# Altium project PreTriggerECAL.PrjPCB (part 3 of 3)

## Sheet In-Channels.SchDoc
size A4; DocumentNumber: 2; SheetNumber: 2; SheetTotal: 6
Used 16 times, as channels In_Ch1, In_Ch2, In_Ch3, In_Ch4, In_Ch5, In_Ch6, In_Ch7, In_Ch8, In_Ch9, In_Ch16, In_Ch15, In_Ch14, In_Ch13, In_Ch12, In_Ch11, In_Ch10. Parts and nets are listed once, with the designators drawn on the sheet.
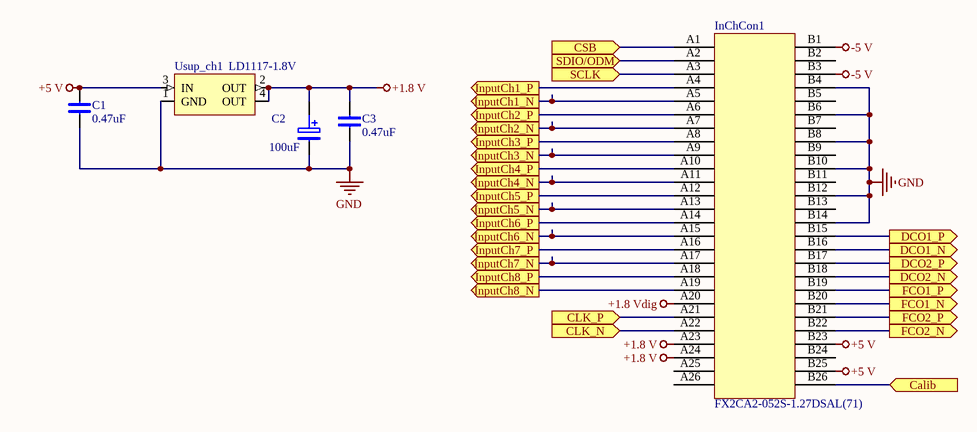
[diagram p6: In-Channels.SchDoc]

### Parts
C1  0.47uF  [chip0603]
C2  100uF  [CEL-SMD300]
C3  0.47uF  [chip0603]
InChCon1  FX2CA2-052S-1.27DSAL(71)  [FX2CA2-052S-1.27DSAL(71)]
Usup_ch1  LD1117-1.8V  [TO-252]

### Ports
Calib (in), CLK_N (in), CLK_P (in), CSB (in), DCO1_N (out), DCO1_P (out), DCO2_N (out), DCO2_P (out), FCO1_N (out), FCO1_P (out), FCO2_N (out), FCO2_P (out), InputCh1_N (out), InputCh1_P (out), InputCh2_N (out), InputCh2_P (out), InputCh3_N (out), InputCh3_P (out), InputCh4_N (out), InputCh4_P (out), InputCh5_N (out), InputCh5_P (out), InputCh6_N (out), InputCh6_P (out), InputCh7_N (out), InputCh7_P (out), InputCh8_N (out), InputCh8_P (out), SCLK (in), SDIO/ODM (in)

### Nets
+1.8 V: C2.+ C3.1 InChCon1.A23 InChCon1.A24 Usup_ch1.2(OUT) Usup_ch1.4(OUT)
+1.8 Vdig: InChCon1.A20
+5 V: C1.1 InChCon1.B23 InChCon1.B25 Usup_ch1.3(IN)
-5 V: InChCon1.B1 InChCon1.B3
GND: C1.2 C2.- C3.2 InChCon1.B4 InChCon1.B6 InChCon1.B8 InChCon1.B10 InChCon1.B12 InChCon1.B14 Usup_ch1.1(GND)
Calib: InChCon1.B26 ; port Calib
CLK_N: InChCon1.A22 ; port CLK_N
CLK_P: InChCon1.A21 ; port CLK_P
CSB: InChCon1.A1 ; port CSB
DCO1_N: InChCon1.B16 ; port DCO1_N
DCO1_P: InChCon1.B15 ; port DCO1_P
DCO2_N: InChCon1.B18 ; port DCO2_N
DCO2_P: InChCon1.B17 ; port DCO2_P
FCO1_N: InChCon1.B20 ; port FCO1_N
FCO1_P: InChCon1.B19 ; port FCO1_P
FCO2_N: InChCon1.B22 ; port FCO2_N
FCO2_P: InChCon1.B21 ; port FCO2_P
InputCh1_N: InChCon1.A5 ; port InputCh1_N
InputCh1_P: InChCon1.A4 ; port InputCh1_P
InputCh2_N: InChCon1.A7 ; port InputCh2_N
InputCh2_P: InChCon1.A6 ; port InputCh2_P
InputCh3_N: InChCon1.A9 ; port InputCh3_N
InputCh3_P: InChCon1.A8 ; port InputCh3_P
InputCh4_N: InChCon1.A11 ; port InputCh4_N
InputCh4_P: InChCon1.A10 ; port InputCh4_P
InputCh5_N: InChCon1.A13 ; port InputCh5_N
InputCh5_P: InChCon1.A12 ; port InputCh5_P
InputCh6_N: InChCon1.A15 ; port InputCh6_N
InputCh6_P: InChCon1.A14 ; port InputCh6_P
InputCh7_N: InChCon1.A17 ; port InputCh7_N
InputCh7_P: InChCon1.A16 ; port InputCh7_P
InputCh8_N: InChCon1.A19 ; port InputCh8_N
InputCh8_P: InChCon1.A18 ; port InputCh8_P
SCLK: InChCon1.A3 ; port SCLK
SDIO/ODM: InChCon1.A2 ; port SDIO/ODM

Not connected (* = marked no-connect by the designer): InChCon1 A25 A26 B2(2) B5(5) B7(7) B9(9) B11(11) B13(13) B24

### Channels
In_Ch1: designators end in _In_Ch1; ports Calib=Calib CLK_N=ADC_DOWN_CLK_N CLK_P=ADC_DOWN_CLK_P CSB=ADC_CSB DCO1_N=DCO_N_1 DCO1_P=DCO_P_1 DCO2_N=DCO_N_2 DCO2_P=DCO_P_2 FCO1_N=FCO_N_1 FCO1_P=FCO_P_1 FCO2_N=FCO_N_2 FCO2_P=FCO_P_2 InputCh1_N=Part1_InputCh1_N InputCh1_P=Part1_InputCh1_P InputCh2_N=Part1_InputCh2_N InputCh2_P=Part1_InputCh2_P InputCh3_N=Part1_InputCh3_N InputCh3_P=Part1_InputCh3_P InputCh4_N=Part1_InputCh4_N InputCh4_P=Part1_InputCh4_P InputCh5_N=Part1_InputCh5_N InputCh5_P=Part1_InputCh5_P InputCh6_N=Part1_InputCh6_N InputCh6_P=Part1_InputCh6_P InputCh7_N=Part1_InputCh7_N InputCh7_P=Part1_InputCh7_P InputCh8_N=Part1_InputCh8_N InputCh8_P=Part1_InputCh8_P SCLK=ADC_SCLK SDIO/ODM=ADC_SDIO/ODM
In_Ch2: designators end in _In_Ch2; ports Calib=Calib CLK_N=ADC_DOWN_CLK_N CLK_P=ADC_DOWN_CLK_P CSB=ADC_CSB DCO1_N=DCO_N_3 DCO1_P=DCO_P_3 DCO2_N=DCO_N_4 DCO2_P=DCO_P_4 FCO1_N=FCO_N_3 FCO1_P=FCO_P_3 FCO2_N=FCO_N_4 FCO2_P=FCO_P_4 InputCh1_N=Part2_InputCh1_N InputCh1_P=Part2_InputCh1_P InputCh2_N=Part2_InputCh2_N InputCh2_P=Part2_InputCh2_P InputCh3_N=Part2_InputCh3_N InputCh3_P=Part2_InputCh3_P InputCh4_N=Part2_InputCh4_N InputCh4_P=Part2_InputCh4_P InputCh5_N=Part2_InputCh5_N InputCh5_P=Part2_InputCh5_P InputCh6_N=Part2_InputCh6_N InputCh6_P=Part2_InputCh6_P InputCh7_N=Part2_InputCh7_N InputCh7_P=Part2_InputCh7_P InputCh8_N=Part2_InputCh8_N InputCh8_P=Part2_InputCh8_P SCLK=ADC_SCLK SDIO/ODM=ADC_SDIO/ODM
In_Ch3: designators end in _In_Ch3; ports Calib=Calib CLK_N=ADC_DOWN_CLK_N CLK_P=ADC_DOWN_CLK_P CSB=ADC_CSB DCO1_N=DCO_N_5 DCO1_P=DCO_P_5 DCO2_N=DCO_N_6 DCO2_P=DCO_P_6 FCO1_N=FCO_N_5 FCO1_P=FCO_P_5 FCO2_N=FCO_N_6 FCO2_P=FCO_P_6 InputCh1_N=Part3_InputCh1_N InputCh1_P=Part3_InputCh1_P InputCh2_N=Part3_InputCh2_N InputCh2_P=Part3_InputCh2_P InputCh3_N=Part3_InputCh3_N InputCh3_P=Part3_InputCh3_P InputCh4_N=Part3_InputCh4_N InputCh4_P=Part3_InputCh4_P InputCh5_N=Part3_InputCh5_N InputCh5_P=Part3_InputCh5_P InputCh6_N=Part3_InputCh6_N InputCh6_P=Part3_InputCh6_P InputCh7_N=Part3_InputCh7_N InputCh7_P=Part3_InputCh7_P InputCh8_N=Part3_InputCh8_N InputCh8_P=Part3_InputCh8_P SCLK=ADC_SCLK SDIO/ODM=ADC_SDIO/ODM
In_Ch4: designators end in _In_Ch4; ports Calib=Calib CLK_N=ADC_DOWN_CLK_N CLK_P=ADC_DOWN_CLK_P CSB=ADC_CSB DCO1_N=DCO_N_7 DCO1_P=DCO_P_7 DCO2_N=DCO_N_8 DCO2_P=DCO_P_8 FCO1_N=FCO_N_7 FCO1_P=FCO_P_7 FCO2_N=FCO_N_8 FCO2_P=FCO_P_8 InputCh1_N=Part4_InputCh1_N InputCh1_P=Part4_InputCh1_P InputCh2_N=Part4_InputCh2_N InputCh2_P=Part4_InputCh2_P InputCh3_N=Part4_InputCh3_N InputCh3_P=Part4_InputCh3_P InputCh4_N=Part4_InputCh4_N InputCh4_P=Part4_InputCh4_P InputCh5_N=Part4_InputCh5_N InputCh5_P=Part4_InputCh5_P InputCh6_N=Part4_InputCh6_N InputCh6_P=Part4_InputCh6_P InputCh7_N=Part4_InputCh7_N InputCh7_P=Part4_InputCh7_P InputCh8_N=Part4_InputCh8_N InputCh8_P=Part4_InputCh8_P SCLK=ADC_SCLK SDIO/ODM=ADC_SDIO/ODM
In_Ch5: designators end in _In_Ch5; ports Calib=Calib CLK_N=ADC_DOWN_CLK_N CLK_P=ADC_DOWN_CLK_P CSB=ADC_CSB DCO1_N=DCO_N_9 DCO1_P=DCO_P_9 DCO2_N=DCO_N_10 DCO2_P=DCO_P_10 FCO1_N=FCO_N_9 FCO1_P=FCO_P_9 FCO2_N=FCO_N_10 FCO2_P=FCO_P_10 InputCh1_N=Part5_InputCh1_N InputCh1_P=Part5_InputCh1_P InputCh2_N=Part5_InputCh2_N InputCh2_P=Part5_InputCh2_P InputCh3_N=Part5_InputCh3_N InputCh3_P=Part5_InputCh3_P InputCh4_N=Part5_InputCh4_N InputCh4_P=Part5_InputCh4_P InputCh5_N=Part5_InputCh5_N InputCh5_P=Part5_InputCh5_P InputCh6_N=Part5_InputCh6_N InputCh6_P=Part5_InputCh6_P InputCh7_N=Part5_InputCh7_N InputCh7_P=Part5_InputCh7_P InputCh8_N=Part5_InputCh8_N InputCh8_P=Part5_InputCh8_P SCLK=ADC_SCLK SDIO/ODM=ADC_SDIO/ODM
In_Ch6: designators end in _In_Ch6; ports Calib=Calib CLK_N=ADC_DOWN_CLK_N CLK_P=ADC_DOWN_CLK_P CSB=ADC_CSB DCO1_N=DCO_N_11 DCO1_P=DCO_P_11 DCO2_N=DCO_N_12 DCO2_P=DCO_P_12 FCO1_N=FCO_N_11 FCO1_P=FCO_P_11 FCO2_N=FCO_N_12 FCO2_P=FCO_P_12 InputCh1_N=Part6_InputCh1_N InputCh1_P=Part6_InputCh1_P InputCh2_N=Part6_InputCh2_N InputCh2_P=Part6_InputCh2_P InputCh3_N=Part6_InputCh3_N InputCh3_P=Part6_InputCh3_P InputCh4_N=Part6_InputCh4_N InputCh4_P=Part6_InputCh4_P InputCh5_N=Part6_InputCh5_N InputCh5_P=Part6_InputCh5_P InputCh6_N=Part6_InputCh6_N InputCh6_P=Part6_InputCh6_P InputCh7_N=Part6_InputCh7_N InputCh7_P=Part6_InputCh7_P InputCh8_N=Part6_InputCh8_N InputCh8_P=Part6_InputCh8_P SCLK=ADC_SCLK SDIO/ODM=ADC_SDIO/ODM
In_Ch7: designators end in _In_Ch7; ports Calib=Calib CLK_N=ADC_DOWN_CLK_N CLK_P=ADC_DOWN_CLK_P CSB=ADC_CSB DCO1_N=DCO_N_13 DCO1_P=DCO_P_13 DCO2_N=DCO_N_14 DCO2_P=DCO_P_14 FCO1_N=FCO_N_13 FCO1_P=FCO_P_13 FCO2_N=FCO_N_14 FCO2_P=FCO_P_14 InputCh1_N=Part7_InputCh1_N InputCh1_P=Part7_InputCh1_P InputCh2_N=Part7_InputCh2_N InputCh2_P=Part7_InputCh2_P InputCh3_N=Part7_InputCh3_N InputCh3_P=Part7_InputCh3_P InputCh4_N=Part7_InputCh4_N InputCh4_P=Part7_InputCh4_P InputCh5_N=Part7_InputCh5_N InputCh5_P=Part7_InputCh5_P InputCh6_N=Part7_InputCh6_N InputCh6_P=Part7_InputCh6_P InputCh7_N=Part7_InputCh7_N InputCh7_P=Part7_InputCh7_P InputCh8_N=Part7_InputCh8_N InputCh8_P=Part7_InputCh8_P SCLK=ADC_SCLK SDIO/ODM=ADC_SDIO/ODM
In_Ch8: designators end in _In_Ch8; ports Calib=Calib CLK_N=ADC_DOWN_CLK_N CLK_P=ADC_DOWN_CLK_P CSB=ADC_CSB DCO1_N=DCO_N_15 DCO1_P=DCO_P_15 DCO2_N=DCO_N_16 DCO2_P=DCO_P_16 FCO1_N=FCO_N_15 FCO1_P=FCO_P_15 FCO2_N=FCO_N_16 FCO2_P=FCO_P_16 InputCh1_N=Part8_InputCh1_N InputCh1_P=Part8_InputCh1_P InputCh2_N=Part8_InputCh2_N InputCh2_P=Part8_InputCh2_P InputCh3_N=Part8_InputCh3_N InputCh3_P=Part8_InputCh3_P InputCh4_N=Part8_InputCh4_N InputCh4_P=Part8_InputCh4_P InputCh5_N=Part8_InputCh5_N InputCh5_P=Part8_InputCh5_P InputCh6_N=Part8_InputCh6_N InputCh6_P=Part8_InputCh6_P InputCh7_N=Part8_InputCh7_N InputCh7_P=Part8_InputCh7_P InputCh8_N=Part8_InputCh8_N InputCh8_P=Part8_InputCh8_P SCLK=ADC_SCLK SDIO/ODM=ADC_SDIO/ODM
In_Ch9: designators end in _In_Ch9; ports Calib=Calib CLK_N=ADC_UP_CLK_N CLK_P=ADC_UP_CLK_P CSB=ADC_CSB DCO1_N=DCO_N_17 DCO1_P=DCO_P_17 DCO2_N=DCO_N_18 DCO2_P=DCO_P_18 FCO1_N=FCO_N_17 FCO1_P=FCO_P_17 FCO2_N=FCO_N_18 FCO2_P=FCO_P_18 InputCh1_N=Part9_InputCh1_N InputCh1_P=Part9_InputCh1_P InputCh2_N=Part9_InputCh2_N InputCh2_P=Part9_InputCh2_P InputCh3_N=Part9_InputCh3_N InputCh3_P=Part9_InputCh3_P InputCh4_N=Part9_InputCh4_N InputCh4_P=Part9_InputCh4_P InputCh5_N=Part9_InputCh5_N InputCh5_P=Part9_InputCh5_P InputCh6_N=Part9_InputCh6_N InputCh6_P=Part9_InputCh6_P InputCh7_N=Part9_InputCh7_N InputCh7_P=Part9_InputCh7_P InputCh8_N=Part9_InputCh8_N InputCh8_P=Part9_InputCh8_P SCLK=ADC_SCLK SDIO/ODM=ADC_SDIO/ODM
In_Ch16: designators end in _In_Ch16; ports Calib=Calib CLK_N=ADC_UP_CLK_N CLK_P=ADC_UP_CLK_P CSB=ADC_CSB DCO1_N=DCO_N_31 DCO1_P=DCO_P_31 DCO2_N=DCO_N_32 DCO2_P=DCO_P_32 FCO1_N=FCO_N_31 FCO1_P=FCO_P_31 FCO2_N=FCO_N_32 FCO2_P=FCO_P_32 InputCh1_N=Part16_InputCh1_N InputCh1_P=Part16_InputCh1_P InputCh2_N=Part16_InputCh2_N InputCh2_P=Part16_InputCh2_P InputCh3_N=Part16_InputCh3_N InputCh3_P=Part16_InputCh3_P InputCh4_N=Part16_InputCh4_N InputCh4_P=Part16_InputCh4_P InputCh5_N=Part16_InputCh5_N InputCh5_P=Part16_InputCh5_P InputCh6_N=Part16_InputCh6_N InputCh6_P=Part16_InputCh6_P InputCh7_N=Part16_InputCh7_N InputCh7_P=Part16_InputCh7_P InputCh8_N=Part16_InputCh8_N InputCh8_P=Part16_InputCh8_P SCLK=ADC_SCLK SDIO/ODM=ADC_SDIO/ODM
In_Ch15: designators end in _In_Ch15; ports Calib=Calib CLK_N=ADC_UP_CLK_N CLK_P=ADC_UP_CLK_P CSB=ADC_CSB DCO1_N=DCO_N_29 DCO1_P=DCO_P_29 DCO2_N=DCO_N_30 DCO2_P=DCO_P_30 FCO1_N=FCO_N_29 FCO1_P=FCO_P_29 FCO2_N=FCO_N_30 FCO2_P=FCO_P_30 InputCh1_N=Part15_InputCh1_N InputCh1_P=Part15_InputCh1_P InputCh2_N=Part15_InputCh2_N InputCh2_P=Part15_InputCh2_P InputCh3_N=Part15_InputCh3_N InputCh3_P=Part15_InputCh3_P InputCh4_N=Part15_InputCh4_N InputCh4_P=Part15_InputCh4_P InputCh5_N=Part15_InputCh5_N InputCh5_P=Part15_InputCh5_P InputCh6_N=Part15_InputCh6_N InputCh6_P=Part15_InputCh6_P InputCh7_N=Part15_InputCh7_N InputCh7_P=Part15_InputCh7_P InputCh8_N=Part15_InputCh8_N InputCh8_P=Part15_InputCh8_P SCLK=ADC_SCLK SDIO/ODM=ADC_SDIO/ODM
In_Ch14: designators end in _In_Ch14; ports Calib=Calib CLK_N=ADC_UP_CLK_N CLK_P=ADC_UP_CLK_P CSB=ADC_CSB DCO1_N=DCO_N_27 DCO1_P=DCO_P_27 DCO2_N=DCO_N_28 DCO2_P=DCO_P_28 FCO1_N=FCO_N_27 FCO1_P=FCO_P_27 FCO2_N=FCO_N_28 FCO2_P=FCO_P_28 InputCh1_N=Part14_InputCh1_N InputCh1_P=Part14_InputCh1_P InputCh2_N=Part14_InputCh2_N InputCh2_P=Part14_InputCh2_P InputCh3_N=Part14_InputCh3_N InputCh3_P=Part14_InputCh3_P InputCh4_N=Part14_InputCh4_N InputCh4_P=Part14_InputCh4_P InputCh5_N=Part14_InputCh5_N InputCh5_P=Part14_InputCh5_P InputCh6_N=Part14_InputCh6_N InputCh6_P=Part14_InputCh6_P InputCh7_N=Part14_InputCh7_N InputCh7_P=Part14_InputCh7_P InputCh8_N=Part14_InputCh8_N InputCh8_P=Part14_InputCh8_P SCLK=ADC_SCLK SDIO/ODM=ADC_SDIO/ODM
In_Ch13: designators end in _In_Ch13; ports Calib=Calib CLK_N=ADC_UP_CLK_N CLK_P=ADC_UP_CLK_P CSB=ADC_CSB DCO1_N=DCO_N_25 DCO1_P=DCO_P_25 DCO2_N=DCO_N_26 DCO2_P=DCO_P_26 FCO1_N=FCO_N_25 FCO1_P=FCO_P_25 FCO2_N=FCO_N_26 FCO2_P=FCO_P_26 InputCh1_N=Part13_InputCh1_N InputCh1_P=Part13_InputCh1_P InputCh2_N=Part13_InputCh2_N InputCh2_P=Part13_InputCh2_P InputCh3_N=Part13_InputCh3_N InputCh3_P=Part13_InputCh3_P InputCh4_N=Part13_InputCh4_N InputCh4_P=Part13_InputCh4_P InputCh5_N=Part13_InputCh5_N InputCh5_P=Part13_InputCh5_P InputCh6_N=Part13_InputCh6_N InputCh6_P=Part13_InputCh6_P InputCh7_N=Part13_InputCh7_N InputCh7_P=Part13_InputCh7_P InputCh8_N=Part13_InputCh8_N InputCh8_P=Part13_InputCh8_P SCLK=ADC_SCLK SDIO/ODM=ADC_SDIO/ODM
In_Ch12: designators end in _In_Ch12; ports Calib=Calib CLK_N=ADC_UP_CLK_N CLK_P=ADC_UP_CLK_P CSB=ADC_CSB DCO1_N=DCO_N_23 DCO1_P=DCO_P_23 DCO2_N=DCO_N_24 DCO2_P=DCO_P_24 FCO1_N=FCO_N_23 FCO1_P=FCO_P_23 FCO2_N=FCO_N_24 FCO2_P=FCO_P_24 InputCh1_N=Part12_InputCh1_N InputCh1_P=Part12_InputCh1_P InputCh2_N=Part12_InputCh2_N InputCh2_P=Part12_InputCh2_P InputCh3_N=Part12_InputCh3_N InputCh3_P=Part12_InputCh3_P InputCh4_N=Part12_InputCh4_N InputCh4_P=Part12_InputCh4_P InputCh5_N=Part12_InputCh5_N InputCh5_P=Part12_InputCh5_P InputCh6_N=Part12_InputCh6_N InputCh6_P=Part12_InputCh6_P InputCh7_N=Part12_InputCh7_N InputCh7_P=Part12_InputCh7_P InputCh8_N=Part12_InputCh8_N InputCh8_P=Part12_InputCh8_P SCLK=ADC_SCLK SDIO/ODM=ADC_SDIO/ODM
In_Ch11: designators end in _In_Ch11; ports Calib=NetInChCon1_In_Ch11_B26 CLK_N=ADC_UP_CLK_N CLK_P=ADC_UP_CLK_P CSB=ADC_CSB DCO1_N=DCO_N_21 DCO1_P=DCO_P_21 DCO2_N=DCO_N_22 DCO2_P=DCO_P_22 FCO1_N=FCO_N_21 FCO1_P=FCO_P_21 FCO2_N=FCO_N_22 FCO2_P=FCO_P_22 InputCh1_N=Part11_InputCh1_N InputCh1_P=Part11_InputCh1_P InputCh2_N=Part11_InputCh2_N InputCh2_P=Part11_InputCh2_P InputCh3_N=Part11_InputCh3_N InputCh3_P=Part11_InputCh3_P InputCh4_N=Part11_InputCh4_N InputCh4_P=Part11_InputCh4_P InputCh5_N=Part11_InputCh5_N InputCh5_P=Part11_InputCh5_P InputCh6_N=Part11_InputCh6_N InputCh6_P=Part11_InputCh6_P InputCh7_N=Part11_InputCh7_N InputCh7_P=Part11_InputCh7_P InputCh8_N=Part11_InputCh8_N InputCh8_P=Part11_InputCh8_P SCLK=ADC_SCLK SDIO/ODM=ADC_SDIO/ODM
In_Ch10: designators end in _In_Ch10; ports Calib=NetInChCon1_In_Ch10_B26 CLK_N=ADC_UP_CLK_N CLK_P=ADC_UP_CLK_P CSB=ADC_CSB DCO1_N=DCO_N_19 DCO1_P=DCO_P_19 DCO2_N=DCO_N_20 DCO2_P=DCO_P_20 FCO1_N=FCO_N_19 FCO1_P=FCO_P_19 FCO2_N=FCO_N_20 FCO2_P=FCO_P_20 InputCh1_N=Part10_InputCh1_N InputCh1_P=Part10_InputCh1_P InputCh2_N=Part10_InputCh2_N InputCh2_P=Part10_InputCh2_P InputCh3_N=Part10_InputCh3_N InputCh3_P=Part10_InputCh3_P InputCh4_N=Part10_InputCh4_N InputCh4_P=Part10_InputCh4_P InputCh5_N=Part10_InputCh5_N InputCh5_P=Part10_InputCh5_P InputCh6_N=Part10_InputCh6_N InputCh6_P=Part10_InputCh6_P InputCh7_N=Part10_InputCh7_N InputCh7_P=Part10_InputCh7_P InputCh8_N=Part10_InputCh8_N InputCh8_P=Part10_InputCh8_P SCLK=ADC_SCLK SDIO/ODM=ADC_SDIO/ODM

### Library data of the parts
C1 C3 = C: Text Field1: 20; Text Field2: 10
C2 = C POL: Text Field1: 20; Text Field2: 20
Usup_ch1 = NCP1117-3.3V

## Sheet Supply.SchDoc
size A4; DocumentNumber: 6; SheetNumber: 6; SheetTotal: 6
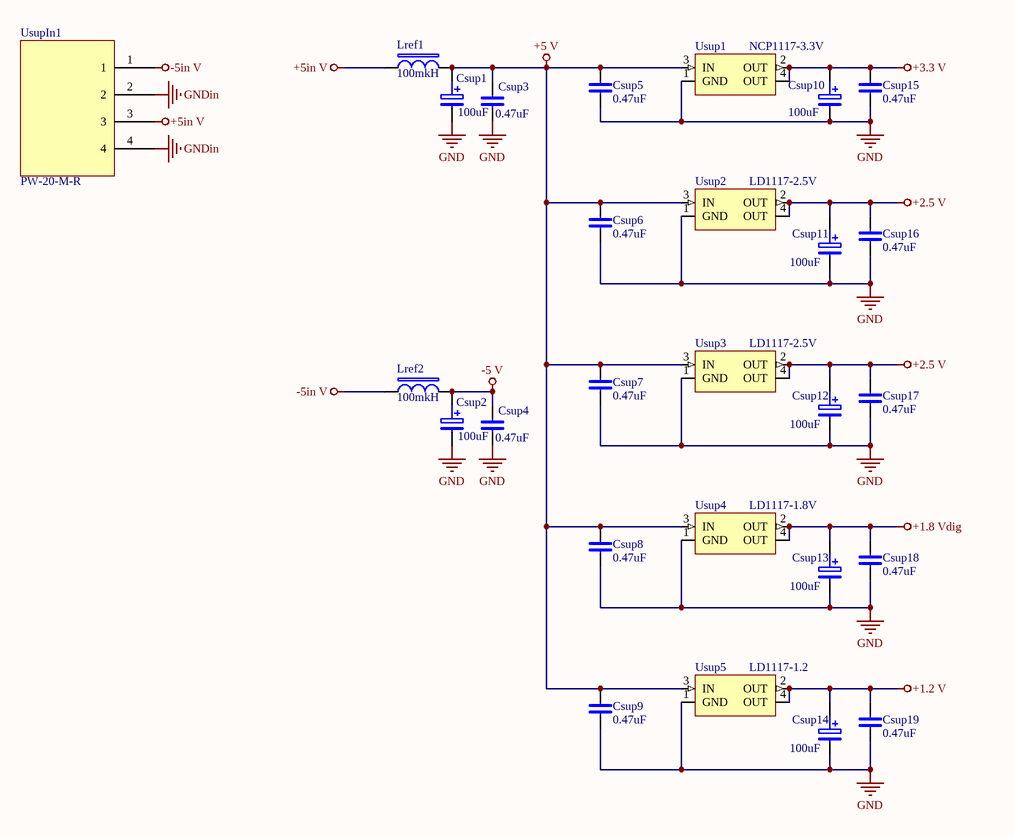
[diagram p7: Supply.SchDoc]

### Parts
Csup1  100uF  [CEL-SMD300]
Csup2  100uF  [CEL-SMD300]
Csup3  0.47uF  [chip0603]
Csup4  0.47uF  [chip0603]
Csup5  0.47uF  [chip0603]
Csup6  0.47uF  [chip0603]
Csup7  0.47uF  [chip0603]
Csup8  0.47uF  [chip0603]
Csup9  0.47uF  [chip0603]
Csup10  100uF  [CEL-SMD300]
Csup11  100uF  [CEL-SMD300]
Csup12  100uF  [CEL-SMD300]
Csup13  100uF  [CEL-SMD300]
Csup14  100uF  [CEL-SMD300]
Csup15  0.47uF  [chip0603]
Csup16  0.47uF  [chip0603]
Csup17  0.47uF  [chip0603]
Csup18  0.47uF  [chip0603]
Csup19  0.47uF  [chip0603]
Lref1  100mkH  [SDR0604]
Lref2  100mkH  [SDR0604]
Usup1  NCP1117-3.3V  [TO-252]
Usup2  LD1117-2.5V  [TO-252]
Usup3  LD1117-2.5V  [TO-252]
Usup4  LD1117-1.8V  [TO-252]
Usup5  LD1117-1.2  [TO-252]
UsupIn1  PW-20-M-R  [PW20-M-R]

### Nets
+1.2 V: Csup14.+ Csup19.1 Usup5.2(OUT) Usup5.4(OUT)
+1.8 Vdig: Csup13.+ Csup18.1 Usup4.2(OUT) Usup4.4(OUT)
+2.5 V: Csup11.+ Csup12.+ Csup16.1 Csup17.1 Usup2.2(OUT) Usup2.4(OUT) Usup3.2(OUT) Usup3.4(OUT)
+3.3 V: Csup10.+ Csup15.1 Usup1.2(OUT) Usup1.4(OUT)
+5 V: Csup1.+ Csup3.1 Csup5.1 Csup6.1 Csup7.1 Csup8.1 Csup9.1 Lref1.2 Usup1.3(IN) Usup2.3(IN) Usup3.3(IN) Usup4.3(IN) Usup5.3(IN)
+5in V: Lref1.1 UsupIn1.3
-5 V: Csup2.+ Csup4.1 Lref2.2
-5in V: Lref2.1 UsupIn1.1
GND: Csup1.- Csup2.- Csup3.2 Csup4.2 Csup5.2 Csup6.2 Csup7.2 Csup8.2 Csup9.2 Csup10.- Csup11.- Csup12.- Csup13.- Csup14.- Csup15.2 Csup16.2 Csup17.2 Csup18.2 Csup19.2 Usup1.1(GND) Usup2.1(GND) Usup3.1(GND) Usup4.1(GND) Usup5.1(GND)
GNDin: UsupIn1.2 UsupIn1.4

### Library data of the parts
Csup1 Csup2 Csup10-Csup14 = C POL: Text Field1: 20; Text Field2: 20
Csup3-Csup9 Csup15-Csup19 = C: Text Field1: 20; Text Field2: 10
Lref1 Lref2 = DR: Text Field1: 30; Text Field2: 10
Usup2-Usup5 = NCP1117-3.3V

## Sheet FCT_connector.SchDoc
size A2; DocumentNumber: 5; SheetNumber: 5; SheetTotal: 6
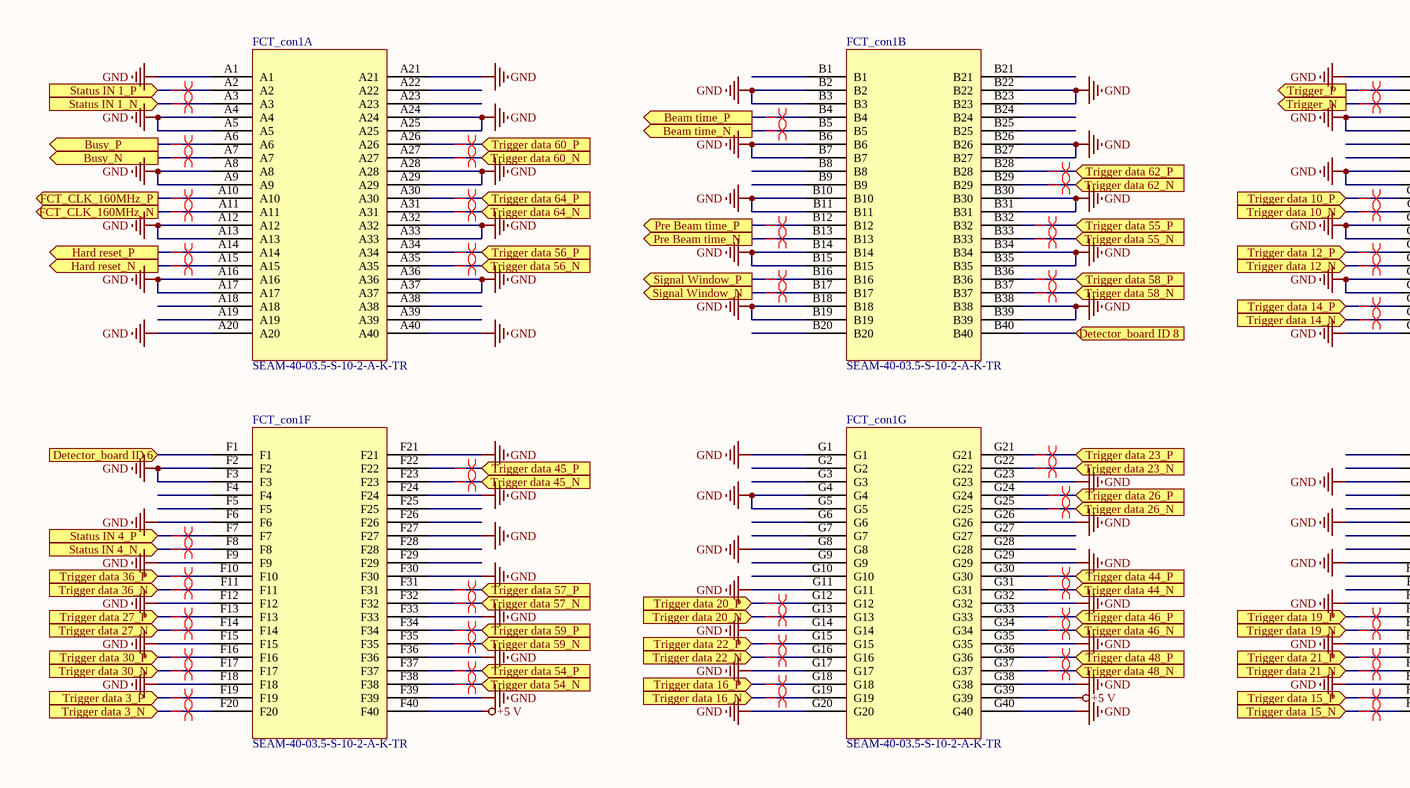
[diagram p8: FCT_connector.SchDoc, left]
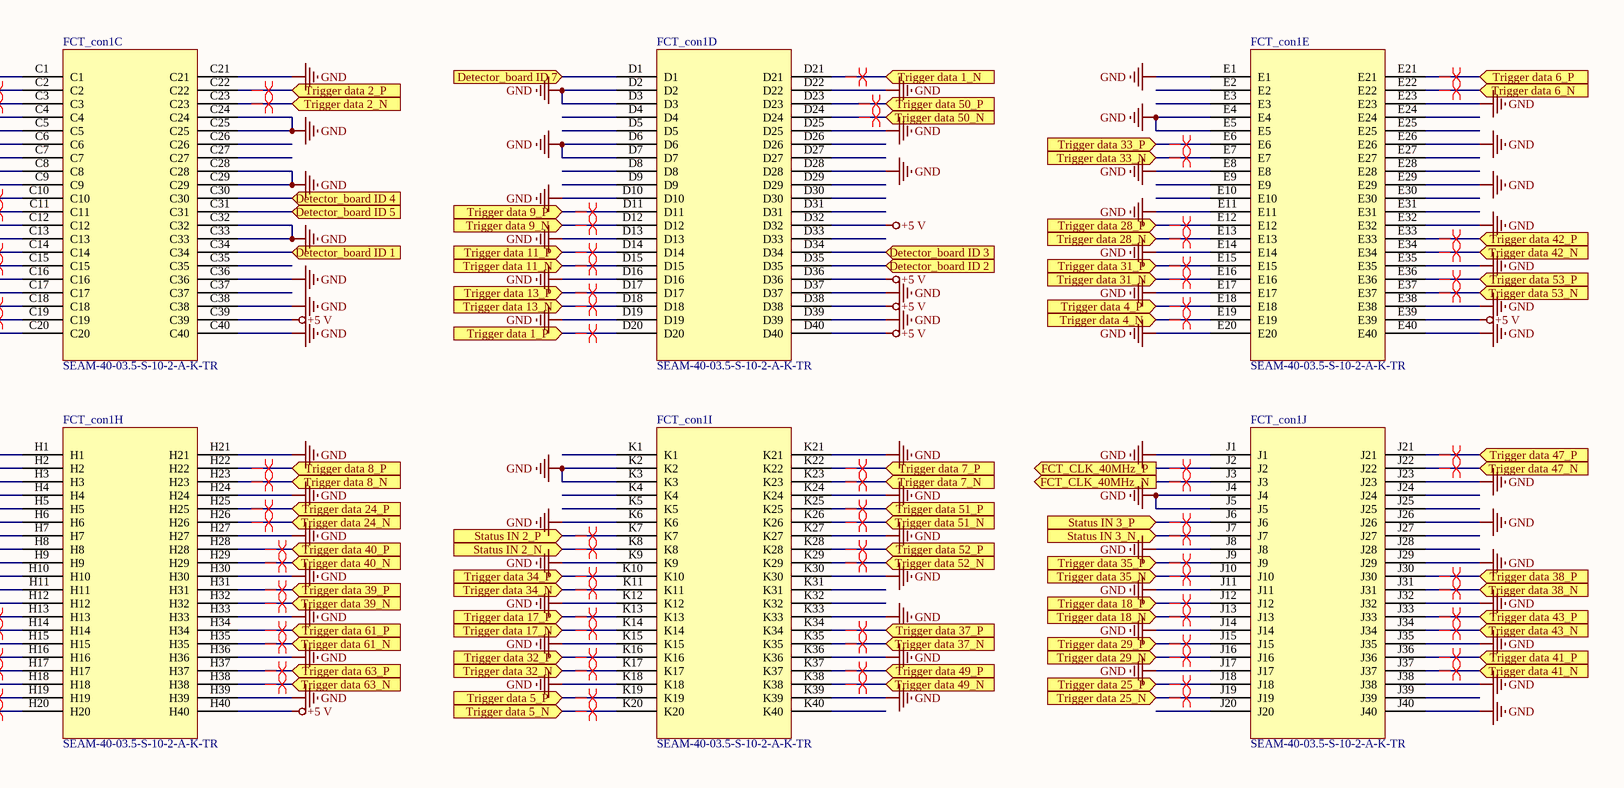
[diagram p9: FCT_connector.SchDoc, right]

### Parts
FCT_con1  SEAM-40-03.5-S-10-2-A-K-TR  [SEAM-40-03.5-S-10-2-A-K-TR]  (parts A,B,C,D,E,F,G,H,I,J of 10)

### Ports
Beam time_N (out), Beam time_P (out), Busy_N (out), Busy_P (out), Detector_board ID 1 (in), Detector_board ID 2 (in), Detector_board ID 3 (in), Detector_board ID 4 (in), Detector_board ID 5 (in), Detector_board ID 6 (in), Detector_board ID 7 (in), Detector_board ID 8 (in), FCT_CLK_40MHz_N (out), FCT_CLK_40MHz_P (out), FCT_CLK_160MHz_N (out), FCT_CLK_160MHz_P (out), Hard reset_N (out), Hard reset_P (out), Pre Beam time_N (out), Pre Beam time_P (out), Signal Window_N (out), Signal Window_P (out), Status IN 1_N (in), Status IN 1_P (in), Status IN 2_N (in), Status IN 2_P (in), Status IN 3_N (in), Status IN 3_P (in), Status IN 4_N (in), Status IN 4_P (in), Trigger data 1_N (in), Trigger data 1_P (in), Trigger data 2_N (in), Trigger data 2_P (in), Trigger data 3_N (in), Trigger data 3_P (in), Trigger data 4_N (in), Trigger data 4_P (in), Trigger data 5_N (in), Trigger data 5_P (in), Trigger data 6_N (in), Trigger data 6_P (in), Trigger data 7_N (in), Trigger data 7_P (in), Trigger data 8_N (in), Trigger data 8_P (in), Trigger data 9_N (in), Trigger data 9_P (in), Trigger data 10_N (in), Trigger data 10_P (in), Trigger data 11_N (in), Trigger data 11_P (in), Trigger data 12_N (in), Trigger data 12_P (in), Trigger data 13_N (in), Trigger data 13_P (in), Trigger data 14_N (in), Trigger data 14_P (in), Trigger data 15_N (in), Trigger data 15_P (in), Trigger data 16_N (in), Trigger data 16_P (in), Trigger data 17_N (in), Trigger data 17_P (in), Trigger data 18_N (in), Trigger data 18_P (in), Trigger data 19_N (in), Trigger data 19_P (in), Trigger data 20_N (in), Trigger data 20_P (in), Trigger data 21_N (in), Trigger data 21_P (in), Trigger data 22_N (in), Trigger data 22_P (in), Trigger data 23_N (in), Trigger data 23_P (in), Trigger data 24_N (in), Trigger data 24_P (in), Trigger data 25_N (in), Trigger data 25_P (in), Trigger data 26_N (in), Trigger data 26_P (in), Trigger data 27_N (in), Trigger data 27_P (in), Trigger data 28_N (in), Trigger data 28_P (in), Trigger data 29_N (in), Trigger data 29_P (in), Trigger data 30_N (in), Trigger data 30_P (in), Trigger data 31_N (in), Trigger data 31_P (in), Trigger data 32_N (in), Trigger data 32_P (in), Trigger data 33_N (in), Trigger data 33_P (in), Trigger data 34_N (in), Trigger data 34_P (in), Trigger data 35_N (in), Trigger data 35_P (in), Trigger data 36_N (in), Trigger data 36_P (in), Trigger data 37_N (in), Trigger data 37_P (in), Trigger data 38_N (in), Trigger data 38_P (in), Trigger data 39_N (in), Trigger data 39_P (in), Trigger data 40_N (in), Trigger data 40_P (in), Trigger data 41_N (in), Trigger data 41_P (in), Trigger data 42_N (in), Trigger data 42_P (in), Trigger data 43_N (in), Trigger data 43_P (in), Trigger data 44_N (in), Trigger data 44_P (in), Trigger data 45_N (in), Trigger data 45_P (in), Trigger data 46_N (in), Trigger data 46_P (in), Trigger data 47_N (in), Trigger data 47_P (in), Trigger data 48_N (in), Trigger data 48_P (in), Trigger data 49_N (in), Trigger data 49_P (in), Trigger data 50_N (in), Trigger data 50_P (in), Trigger data 51_N (in), Trigger data 51_P (in), Trigger data 52_N (in), Trigger data 52_P (in), Trigger data 53_N (in), Trigger data 53_P (in), Trigger data 54_N (in), Trigger data 54_P (in), Trigger data 55_N (in), Trigger data 55_P (in), Trigger data 56_N (in), Trigger data 56_P (in), Trigger data 57_N (in), Trigger data 57_P (in), Trigger data 58_N (in), Trigger data 58_P (in), Trigger data 59_N (in), Trigger data 59_P (in), Trigger data 60_N (in), Trigger data 60_P (in), Trigger data 61_N (in), Trigger data 61_P (in), Trigger data 62_N (in), Trigger data 62_P (in), Trigger data 63_N (in), Trigger data 63_P (in), Trigger data 64_N (in), Trigger data 64_P (in), Trigger_N (out), Trigger_P (out)

### Nets
+5 V: FCT_con1.C39 FCT_con1.D32 FCT_con1.D36 FCT_con1.D38 FCT_con1.D40 FCT_con1.E39 FCT_con1.F40 FCT_con1.G39 FCT_con1.H40
GND: FCT_con1.A1 FCT_con1.A4 FCT_con1.A5 FCT_con1.A8 FCT_con1.A9 FCT_con1.A12 FCT_con1.A13 FCT_con1.A16 FCT_con1.A17 FCT_con1.A20 FCT_con1.A21 FCT_con1.A24 FCT_con1.A25 FCT_con1.A28 FCT_con1.A29 FCT_con1.A32 FCT_con1.A33 FCT_con1.A36 FCT_con1.A37 FCT_con1.A40 FCT_con1.B2 FCT_con1.B3 FCT_con1.B6 FCT_con1.B7 FCT_con1.B10 FCT_con1.B11 FCT_con1.B14 FCT_con1.B15 FCT_con1.B18 FCT_con1.B19 FCT_con1.B22 FCT_con1.B23 FCT_con1.B26 FCT_con1.B27 FCT_con1.B30 FCT_con1.B31 FCT_con1.B34 FCT_con1.B35 FCT_con1.B38 FCT_con1.B39 FCT_con1.C1 FCT_con1.C4 FCT_con1.C5 FCT_con1.C8 FCT_con1.C9 FCT_con1.C12 FCT_con1.C13 FCT_con1.C16 FCT_con1.C17 FCT_con1.C20 FCT_con1.C21 FCT_con1.C24 FCT_con1.C25 FCT_con1.C28 FCT_con1.C29 FCT_con1.C32 FCT_con1.C33 FCT_con1.C36 FCT_con1.C38 FCT_con1.C40 FCT_con1.D2 FCT_con1.D3 FCT_con1.D6 FCT_con1.D7 FCT_con1.D10 FCT_con1.D13 FCT_con1.D16 FCT_con1.D19 FCT_con1.D22 FCT_con1.D25 FCT_con1.D28 FCT_con1.D37 FCT_con1.D39 FCT_con1.E1 FCT_con1.E4 FCT_con1.E5 FCT_con1.E8 FCT_con1.E11 FCT_con1.E14 FCT_con1.E17 FCT_con1.E20 FCT_con1.E23 FCT_con1.E26 FCT_con1.E29 FCT_con1.E32 FCT_con1.E35 FCT_con1.E38 FCT_con1.E40 FCT_con1.F2 FCT_con1.F3 FCT_con1.F6 FCT_con1.F9 FCT_con1.F12 FCT_con1.F15 FCT_con1.F18 FCT_con1.F21 FCT_con1.F24 FCT_con1.F27 FCT_con1.F30 FCT_con1.F33 FCT_con1.F36 FCT_con1.F39 FCT_con1.G1 FCT_con1.G4 FCT_con1.G5 FCT_con1.G8 FCT_con1.G11 FCT_con1.G14 FCT_con1.G17 FCT_con1.G20 FCT_con1.G23 FCT_con1.G26 FCT_con1.G29 FCT_con1.G32 FCT_con1.G35 FCT_con1.G38 FCT_con1.G40 FCT_con1.H3 FCT_con1.H6 FCT_con1.H9 FCT_con1.H12 FCT_con1.H15 FCT_con1.H18 FCT_con1.H21 FCT_con1.H24 FCT_con1.H27 FCT_con1.H30 FCT_con1.H33 FCT_con1.H36 FCT_con1.H39 FCT_con1.J1 FCT_con1.J4 FCT_con1.J5 FCT_con1.J8 FCT_con1.J11 FCT_con1.J14 FCT_con1.J17 FCT_con1.J23 FCT_con1.J26 FCT_con1.J29 FCT_con1.J32 FCT_con1.J35 FCT_con1.J38 FCT_con1.J40 FCT_con1.K2 FCT_con1.K3 FCT_con1.K6 FCT_con1.K9 FCT_con1.K12 FCT_con1.K15 FCT_con1.K18 FCT_con1.K21 FCT_con1.K24 FCT_con1.K27 FCT_con1.K30 FCT_con1.K33 FCT_con1.K36 FCT_con1.K39
Beam time_N: FCT_con1.B5 ; port Beam time_N
Beam time_P: FCT_con1.B4 ; port Beam time_P
Busy_N: FCT_con1.A7 ; port Busy_N
Busy_P: FCT_con1.A6 ; port Busy_P
Detector_board ID 1: FCT_con1.C34 ; port Detector_board ID 1
Detector_board ID 2: FCT_con1.D35 ; port Detector_board ID 2
Detector_board ID 3: FCT_con1.D34 ; port Detector_board ID 3
Detector_board ID 4: FCT_con1.C30 ; port Detector_board ID 4
Detector_board ID 5: FCT_con1.C31 ; port Detector_board ID 5
Detector_board ID 6: FCT_con1.F1 ; port Detector_board ID 6
Detector_board ID 7: FCT_con1.D1 ; port Detector_board ID 7
Detector_board ID 8: FCT_con1.B40 ; port Detector_board ID 8
FCT_CLK_40MHz_N: FCT_con1.J3 ; port FCT_CLK_40MHz_N
FCT_CLK_40MHz_P: FCT_con1.J2 ; port FCT_CLK_40MHz_P
FCT_CLK_160MHz_N: FCT_con1.A11 ; port FCT_CLK_160MHz_N
FCT_CLK_160MHz_P: FCT_con1.A10 ; port FCT_CLK_160MHz_P
Hard reset_N: FCT_con1.A15 ; port Hard reset_N
Hard reset_P: FCT_con1.A14 ; port Hard reset_P
Pre Beam time_N: FCT_con1.B13 ; port Pre Beam time_N
Pre Beam time_P: FCT_con1.B12 ; port Pre Beam time_P
Signal Window_N: FCT_con1.B17 ; port Signal Window_N
Signal Window_P: FCT_con1.B16 ; port Signal Window_P
Status IN 1_N: FCT_con1.A3 ; port Status IN 1_N
Status IN 1_P: FCT_con1.A2 ; port Status IN 1_P
Status IN 2_N: FCT_con1.K8 ; port Status IN 2_N
Status IN 2_P: FCT_con1.K7 ; port Status IN 2_P
Status IN 3_N: FCT_con1.J7 ; port Status IN 3_N
Status IN 3_P: FCT_con1.J6 ; port Status IN 3_P
Status IN 4_N: FCT_con1.F8 ; port Status IN 4_N
Status IN 4_P: FCT_con1.F7 ; port Status IN 4_P
Trigger data1_N: FCT_con1.D21 ; port Trigger data 1_N
Trigger data1_P: FCT_con1.D20 ; port Trigger data 1_P
Trigger data2_N: FCT_con1.C23 ; port Trigger data 2_N
Trigger data2_P: FCT_con1.C22 ; port Trigger data 2_P
Trigger data3_N: FCT_con1.F20 ; port Trigger data 3_N
Trigger data3_P: FCT_con1.F19 ; port Trigger data 3_P
Trigger data4_N: FCT_con1.E19 ; port Trigger data 4_N
Trigger data4_P: FCT_con1.E18 ; port Trigger data 4_P
Trigger data5_N: FCT_con1.K20 ; port Trigger data 5_N
Trigger data5_P: FCT_con1.K19 ; port Trigger data 5_P
Trigger data6_N: FCT_con1.E22 ; port Trigger data 6_N
Trigger data6_P: FCT_con1.E21 ; port Trigger data 6_P
Trigger data7_N: FCT_con1.K23 ; port Trigger data 7_N
Trigger data7_P: FCT_con1.K22 ; port Trigger data 7_P
Trigger data8_N: FCT_con1.H23 ; port Trigger data 8_N
Trigger data8_P: FCT_con1.H22 ; port Trigger data 8_P
Trigger data9_N: FCT_con1.D12 ; port Trigger data 9_N
Trigger data9_P: FCT_con1.D11 ; port Trigger data 9_P
Trigger data10_N: FCT_con1.C11 ; port Trigger data 10_N
Trigger data10_P: FCT_con1.C10 ; port Trigger data 10_P
Trigger data11_N: FCT_con1.D15 ; port Trigger data 11_N
Trigger data11_P: FCT_con1.D14 ; port Trigger data 11_P
Trigger data12_N: FCT_con1.C15 ; port Trigger data 12_N
Trigger data12_P: FCT_con1.C14 ; port Trigger data 12_P
Trigger data13_N: FCT_con1.D18 ; port Trigger data 13_N
Trigger data13_P: FCT_con1.D17 ; port Trigger data 13_P
Trigger data14_N: FCT_con1.C19 ; port Trigger data 14_N
Trigger data14_P: FCT_con1.C18 ; port Trigger data 14_P
Trigger data15_N: FCT_con1.H20 ; port Trigger data 15_N
Trigger data15_P: FCT_con1.H19 ; port Trigger data 15_P
Trigger data16_N: FCT_con1.G19 ; port Trigger data 16_N
Trigger data16_P: FCT_con1.G18 ; port Trigger data 16_P
Trigger data17_N: FCT_con1.K14 ; port Trigger data 17_N
Trigger data17_P: FCT_con1.K13 ; port Trigger data 17_P
Trigger data18_N: FCT_con1.J13 ; port Trigger data 18_N
Trigger data18_P: FCT_con1.J12 ; port Trigger data 18_P
Trigger data19_N: FCT_con1.H14 ; port Trigger data 19_N
Trigger data19_P: FCT_con1.H13 ; port Trigger data 19_P
Trigger data20_N: FCT_con1.G13 ; port Trigger data 20_N
Trigger data20_P: FCT_con1.G12 ; port Trigger data 20_P
Trigger data21_N: FCT_con1.H17 ; port Trigger data 21_N
Trigger data21_P: FCT_con1.H16 ; port Trigger data 21_P
Trigger data22_N: FCT_con1.G16 ; port Trigger data 22_N
Trigger data22_P: FCT_con1.G15 ; port Trigger data 22_P
Trigger data23_N: FCT_con1.G22 ; port Trigger data 23_N
Trigger data23_P: FCT_con1.G21 ; port Trigger data 23_P
Trigger data24_N: FCT_con1.H26 ; port Trigger data 24_N
Trigger data24_P: FCT_con1.H25 ; port Trigger data 24_P
Trigger data25_N: FCT_con1.J19 ; port Trigger data 25_N
Trigger data25_P: FCT_con1.J18 ; port Trigger data 25_P
Trigger data26_N: FCT_con1.G25 ; port Trigger data 26_N
Trigger data26_P: FCT_con1.G24 ; port Trigger data 26_P
Trigger data27_N: FCT_con1.F14 ; port Trigger data 27_N
Trigger data27_P: FCT_con1.F13 ; port Trigger data 27_P
Trigger data28_N: FCT_con1.E13 ; port Trigger data 28_N
Trigger data28_P: FCT_con1.E12 ; port Trigger data 28_P
Trigger data29_N: FCT_con1.J16 ; port Trigger data 29_N
Trigger data29_P: FCT_con1.J15 ; port Trigger data 29_P
Trigger data30_N: FCT_con1.F17 ; port Trigger data 30_N
Trigger data30_P: FCT_con1.F16 ; port Trigger data 30_P
Trigger data31_N: FCT_con1.E16 ; port Trigger data 31_N
Trigger data31_P: FCT_con1.E15 ; port Trigger data 31_P
Trigger data32_N: FCT_con1.K17 ; port Trigger data 32_N
Trigger data32_P: FCT_con1.K16 ; port Trigger data 32_P
Trigger data33_N: FCT_con1.E7 ; port Trigger data 33_N
Trigger data33_P: FCT_con1.E6 ; port Trigger data 33_P
Trigger data34_N: FCT_con1.K11 ; port Trigger data 34_N
Trigger data34_P: FCT_con1.K10 ; port Trigger data 34_P
Trigger data35_N: FCT_con1.J10 ; port Trigger data 35_N
Trigger data35_P: FCT_con1.J9 ; port Trigger data 35_P
Trigger data36_N: FCT_con1.F11 ; port Trigger data 36_N
Trigger data36_P: FCT_con1.F10 ; port Trigger data 36_P
Trigger data37_N: FCT_con1.K35 ; port Trigger data 37_N
Trigger data37_P: FCT_con1.K34 ; port Trigger data 37_P
Trigger data38_N: FCT_con1.J31 ; port Trigger data 38_N
Trigger data38_P: FCT_con1.J30 ; port Trigger data 38_P
Trigger data39_N: FCT_con1.H32 ; port Trigger data 39_N
Trigger data39_P: FCT_con1.H31 ; port Trigger data 39_P
Trigger data40_N: FCT_con1.H29 ; port Trigger data 40_N
Trigger data40_P: FCT_con1.H28 ; port Trigger data 40_P
Trigger data41_N: FCT_con1.J37 ; port Trigger data 41_N
Trigger data41_P: FCT_con1.J36 ; port Trigger data 41_P
Trigger data42_N: FCT_con1.E34 ; port Trigger data 42_N
Trigger data42_P: FCT_con1.E33 ; port Trigger data 42_P
Trigger data43_N: FCT_con1.J34 ; port Trigger data 43_N
Trigger data43_P: FCT_con1.J33 ; port Trigger data 43_P
Trigger data44_N: FCT_con1.G31 ; port Trigger data 44_N
Trigger data44_P: FCT_con1.G30 ; port Trigger data 44_P
Trigger data45_N: FCT_con1.F23 ; port Trigger data 45_N
Trigger data45_P: FCT_con1.F22 ; port Trigger data 45_P
Trigger data46_N: FCT_con1.G34 ; port Trigger data 46_N
Trigger data46_P: FCT_con1.G33 ; port Trigger data 46_P
Trigger data47_N: FCT_con1.J22 ; port Trigger data 47_N
Trigger data47_P: FCT_con1.J21 ; port Trigger data 47_P
Trigger data48_N: FCT_con1.G37 ; port Trigger data 48_N
Trigger data48_P: FCT_con1.G36 ; port Trigger data 48_P
Trigger data49_N: FCT_con1.K38 ; port Trigger data 49_N
Trigger data49_P: FCT_con1.K37 ; port Trigger data 49_P
Trigger data50_N: FCT_con1.D24 ; port Trigger data 50_N
Trigger data50_P: FCT_con1.D23 ; port Trigger data 50_P
Trigger data51_N: FCT_con1.K26 ; port Trigger data 51_N
Trigger data51_P: FCT_con1.K25 ; port Trigger data 51_P
Trigger data52_N: FCT_con1.K29 ; port Trigger data 52_N
Trigger data52_P: FCT_con1.K28 ; port Trigger data 52_P
Trigger data53_N: FCT_con1.E37 ; port Trigger data 53_N
Trigger data53_P: FCT_con1.E36 ; port Trigger data 53_P
Trigger data54_N: FCT_con1.F38 ; port Trigger data 54_N
Trigger data54_P: FCT_con1.F37 ; port Trigger data 54_P
Trigger data55_N: FCT_con1.B33 ; port Trigger data 55_N
Trigger data55_P: FCT_con1.B32 ; port Trigger data 55_P
Trigger data56_N: FCT_con1.A35 ; port Trigger data 56_N
Trigger data56_P: FCT_con1.A34 ; port Trigger data 56_P
Trigger data57_N: FCT_con1.F32 ; port Trigger data 57_N
Trigger data57_P: FCT_con1.F31 ; port Trigger data 57_P
Trigger data58_N: FCT_con1.B37 ; port Trigger data 58_N
Trigger data58_P: FCT_con1.B36 ; port Trigger data 58_P
Trigger data59_N: FCT_con1.F35 ; port Trigger data 59_N
Trigger data59_P: FCT_con1.F34 ; port Trigger data 59_P
Trigger data60_N: FCT_con1.A27 ; port Trigger data 60_N
Trigger data60_P: FCT_con1.A26 ; port Trigger data 60_P
Trigger data61_N: FCT_con1.H35 ; port Trigger data 61_N
Trigger data61_P: FCT_con1.H34 ; port Trigger data 61_P
Trigger data62_N: FCT_con1.B29 ; port Trigger data 62_N
Trigger data62_P: FCT_con1.B28 ; port Trigger data 62_P
Trigger data63_N: FCT_con1.H38 ; port Trigger data 63_N
Trigger data63_P: FCT_con1.H37 ; port Trigger data 63_P
Trigger data64_N: FCT_con1.A31 ; port Trigger data 64_N
Trigger data64_P: FCT_con1.A30 ; port Trigger data 64_P
Trigger_N: FCT_con1.C3 ; port Trigger_N
Trigger_P: FCT_con1.C2 ; port Trigger_P

Not connected (* = marked no-connect by the designer): FCT_con1 A18 A19 A22 A23 A38 A39 B1 B8 B9 B20 B21 B24 B25 C6 C7 C26 C27 C35 C37 D4 D5 D8 D9 D26 D27 D29 D30 D31 D33 E2 E3 E9 E10 E24 E25 E27 E28 E30 E31 F4 F5 F25 F26 F28 F29 G2 G3 G6 G7 G9 G10 G27 G28 H1 H2 H4 H5 H7 H8 H10 H11 J20 J24 J25 J27 J28 J39 K1 K4 K5 K31 K32 K40

### Layout directives
differential pair: Beam time_N, Beam time_P, Busy_N, Busy_P, FCT_CLK_40MHz_N, FCT_CLK_40MHz_P, FCT_CLK_160MHz_N, FCT_CLK_160MHz_P, Hard reset_N, Hard reset_P, Pre Beam time_N, Pre Beam time_P, Signal Window_N, Signal Window_P, Status IN 1_N, Status IN 1_P, Status IN 2_N, Status IN 2_P, Status IN 3_N, Status IN 3_P, Status IN 4_N, Status IN 4_P, Trigger data1_N, Trigger data1_P, Trigger data2_N, Trigger data2_P, Trigger data3_N, Trigger data3_P, Trigger data4_N, Trigger data4_P, Trigger data5_N, Trigger data5_P, Trigger data6_N, Trigger data6_P, Trigger data7_N, Trigger data7_P, Trigger data8_N, Trigger data8_P, Trigger data9_N, Trigger data9_P, Trigger data10_N, Trigger data10_P, Trigger data11_N, Trigger data11_P, Trigger data12_N, Trigger data12_P, Trigger data13_N, Trigger data13_P, Trigger data14_N, Trigger data14_P, Trigger data15_N, Trigger data15_P, Trigger data16_N, Trigger data16_P, Trigger data17_N, Trigger data17_P, Trigger data18_N, Trigger data18_P, Trigger data19_N, Trigger data19_P, Trigger data20_N, Trigger data20_P, Trigger data21_N, Trigger data21_P, Trigger data22_N, Trigger data22_P, Trigger data23_N, Trigger data23_P, Trigger data24_N, Trigger data24_P, Trigger data25_N, Trigger data25_P, Trigger data26_N, Trigger data26_P, Trigger data27_N, Trigger data27_P, Trigger data28_N, Trigger data28_P, Trigger data29_N, Trigger data29_P, Trigger data30_N, Trigger data30_P, Trigger data31_N, Trigger data31_P, Trigger data32_N, Trigger data32_P, Trigger data33_N, Trigger data33_P, Trigger data34_N, Trigger data34_P, Trigger data35_N, Trigger data35_P, Trigger data36_N, Trigger data36_P, Trigger data37_N, Trigger data37_P, Trigger data38_N, Trigger data38_P, Trigger data39_N, Trigger data39_P, Trigger data40_N, Trigger data40_P, Trigger data41_N, Trigger data41_P, Trigger data42_N, Trigger data42_P, Trigger data43_N, Trigger data43_P, Trigger data44_N, Trigger data44_P, Trigger data45_N, Trigger data45_P, Trigger data46_N, Trigger data46_P, Trigger data47_N, Trigger data47_P, Trigger data48_N, Trigger data48_P, Trigger data49_N, Trigger data49_P, Trigger data50_N, Trigger data50_P, Trigger data51_N, Trigger data51_P, Trigger data52_N, Trigger data52_P, Trigger data53_N, Trigger data53_P, Trigger data54_N, Trigger data54_P, Trigger data55_N, Trigger data55_P, Trigger data56_N, Trigger data56_P, Trigger data57_N, Trigger data57_P, Trigger data58_N, Trigger data58_P, Trigger data59_N, Trigger data59_P, Trigger data60_N, Trigger data60_P, Trigger data61_N, Trigger data61_P, Trigger data62_N, Trigger data62_P, Trigger data63_N, Trigger data63_P, Trigger data64_N, Trigger data64_P, Trigger_N, Trigger_P

## Sheet Ethernet.SchDoc
size A3; DocumentNumber: 4; SheetNumber: 4; SheetTotal: 6
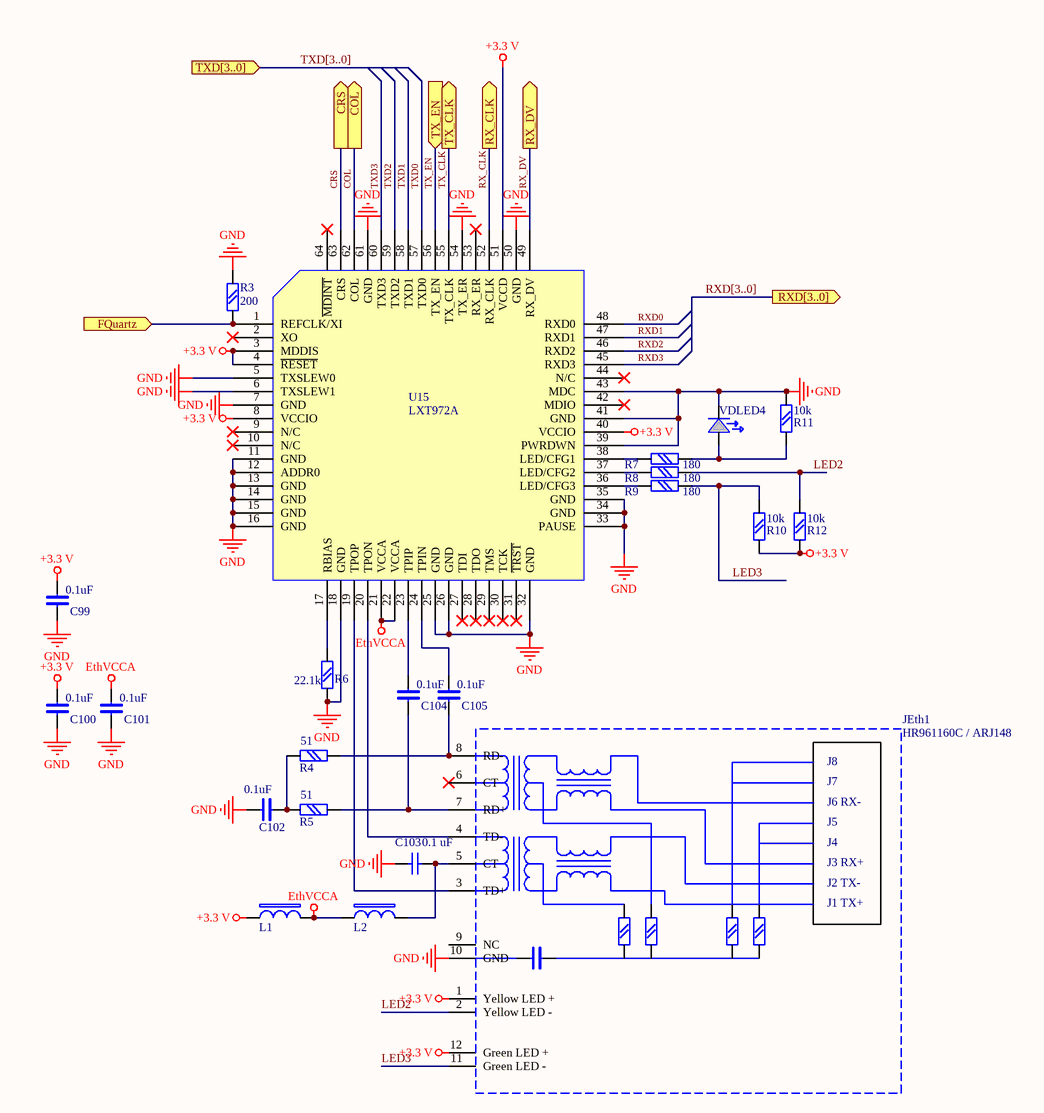
[diagram p10: Ethernet.SchDoc]

### Parts
C99  0.1uF  [chip0603]
C100  0.1uF  [chip0603]
C101  0.1uF  [chip0603]
C102  0.1uF  [chip0603]
C103  value 0.1 uF  [chip0603]  (hidden comment: 0.1uF)
C104  0.1uF  [chip0603]
C105  0.1uF  [chip0603]
JEth1  HR961160C / ARJ148  [HR961160C]
L1  DR  [chip0805]  (value not drawn)
L2  DR  [chip0805]  (value not drawn)
R3  200  [chip0603]
R4  51  [chip0603]
R5  51  [chip0603]
R6  22.1k  [chip0603]
R7  180  [chip0603]
R8  180  [chip0603]
R9  180  [chip0603]
R10  10k  [chip0603]
R11  10k  [chip0603]
R12  10k  [chip0603]
U15  LXT972A  [TQFP64]
VDLED4  LED  [LED2P5_H]  (value not drawn)

### Ports
COL (out), CRS (out), FQuartz (in), RX_CLK (out), RX_DV (out), RXD[3..0] (out), TX_CLK (out), TX_EN (in), TXD[3..0] (in)

### Nets
+3.3 V: C99.2 C100.2 JEth1.1(Yellow_LED_+) JEth1.12(Green_LED_+) L1.1 R10.1 R12.1 U15.3(MDDIS) U15.4(~{RESET}) U15.8(VCCIO) U15.40(VCCIO) U15.51(VCCD)
EthVCCA: C101.2 L1.2 L2.1 U15.21(VCCA) U15.22(VCCA)
GND: C99.1 C100.1 C101.1 C102.2 C103.1 JEth1.10(GND) R3.2 R6.2 R11.2 U15.5(TXSLEW0) U15.6(TXSLEW1) U15.7(GND) U15.11(GND) U15.12(ADDR0) U15.13(GND) U15.14(GND) U15.15(GND) U15.16(GND) U15.18(GND) U15.25(GND) U15.26(GND) U15.32(GND) U15.33(PAUSE) U15.34(GND) U15.35(GND) U15.39(PWRDWN) U15.41(GND) U15.43(MDC) U15.50(GND) U15.54(TX_ER) U15.61(GND) VDLED4.CATH
COL: U15.62(COL) ; port COL
CRS: U15.63(CRS) ; port CRS
FQuartz: R3.1 U15.1(REFCLK/XI) ; port FQuartz
LED2: JEth1.2(Yellow_LED_-) R8.2 R12.2
LED3: JEth1.11(Green_LED_-) R9.2 R10.2
RX_CLK: U15.52(RX_CLK) ; port RX_CLK
RX_DV: U15.49(RX_DV) ; port RX_DV
RXD0: U15.48(RXD0)
RXD1: U15.47(RXD1)
RXD2: U15.46(RXD2)
RXD3: U15.45(RXD3)
TX_CLK: U15.55(TX_CLK) ; port TX_CLK
TX_EN: U15.56(TX_EN) ; port TX_EN
TXD0: U15.57(TXD0)
TXD1: U15.58(TXD1)
TXD2: U15.59(TXD2)
TXD3: U15.60(TXD3)
NetC102_1: C102.1 R4.1 R5.2
NetC103_2: C103.2 JEth1.5(CT) L2.2
NetC104_1: C104.1 JEth1.7(RD+) R5.1
NetC104_2: C104.2 U15.23(TPIP)
NetC105_1: C105.1 JEth1.8(RD-) R4.2
NetC105_2: C105.2 U15.24(TPIN)
NetJEth1_3: JEth1.3(TD+) U15.19(TPOP)
NetJEth1_4: JEth1.4(TD-) U15.20(TPON)
NetR6_1: R6.1 U15.17(RBIAS)
NetR7_1: R7.1 U15.38(LED/CFG1)
NetR7_2: R7.2 R11.1 VDLED4.ANOD
NetR8_1: R8.1 U15.37(LED/CFG2)
NetR9_1: R9.1 U15.36(LED/CFG3)

Not connected (* = marked no-connect by the designer): JEth1 6(CT)* 9(NC); U15 2(XO)* 9(N/C)* 10(N/C)* 27(TDI)* 28(TDO)* 29(TMS)* 30(TCK)* 31(~{TRST})* 42(MDIO)* 44(N/C)* 53(RX_ER)* 64(~{MDINT})*

### Buses and harness runs
bus RXD[3..0] = port RXD[3..0]
bus TXD[3..0] = port TXD[3..0]

### Notes on the sheet
- (in symbol HR961160C) J8; J7; J6 RX-; J5; J4; J3 RX+; J2 TX-; J1 TX+

### Library data of the parts
C99-C102 C104 C105 = C: Text Field1: 20; Text Field2: 10
C103 = Cap: Capacitor; Published: 8-Jun-2000; LatestRevisionDate: 17-Jul-2002; LatestRevisionNote: Re-released for DXP Platform.; Publisher: Altium Limited
JEth1 = HR961160C
L1 L2 = L: Text Field1: 30; Text Field2: 10
R3-R12 = R: Text Field1: 20; Text Field2: 20
VDLED4 = AL307: Text Field1: 10; Text Field2: 30

## Sheet Clk.SchDoc
size A4
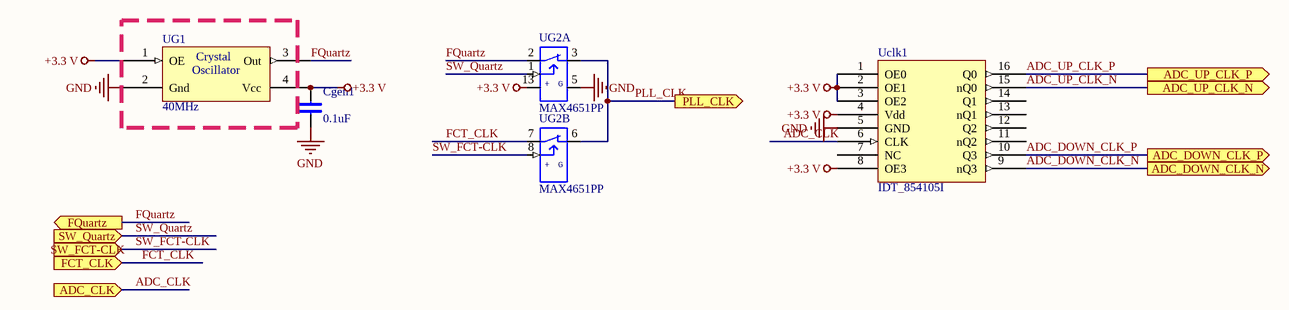
[diagram p11: Clk.SchDoc]

### Parts
Cgen1  0.1uF  [chip0603]
Uclk1  IDT_854105I  [TSSOP16]
UG1  40MHz  [SG 5*3.2]
UG2  MAX4651PP  [16SOIC150]  (parts A,B of 4)

### Ports
ADC_CLK (in), ADC_DOWN_CLK_N (out), ADC_DOWN_CLK_P (out), ADC_UP_CLK_N (out), ADC_UP_CLK_P (out), FCT_CLK (in), FQuartz (out), PLL_CLK (out), SW_FCT-CLK (in), SW_Quartz (in)

### Nets
+3.3 V: Cgen1.2 Uclk1.1(OE0) Uclk1.2(OE1) Uclk1.3(OE2) Uclk1.4(Vdd) Uclk1.8(OE3) UG1.1(OE) UG1.4(Vcc) UG2.13(VCC)
GND: Cgen1.1 Uclk1.5(GND) UG1.2(Gnd) UG2.5(GND)
ADC_CLK: Uclk1.6(CLK) ; port ADC_CLK
ADC_DOWN_CLK_N: Uclk1.9(nQ3) ; port ADC_DOWN_CLK_N
ADC_DOWN_CLK_P: Uclk1.10(Q3) ; port ADC_DOWN_CLK_P
ADC_UP_CLK_N: Uclk1.15(nQ0) ; port ADC_UP_CLK_N
ADC_UP_CLK_P: Uclk1.16(Q0) ; port ADC_UP_CLK_P
FCT_CLK: UG2.7(IN) ; port FCT_CLK
FQuartz: UG1.3(Out) UG2.2(IN) ; port FQuartz
PLL_CLK: UG2.3(OUT) UG2.6(OUT) ; port PLL_CLK
SW_FCT-CLK: UG2.8(CONTROL) ; port SW_FCT-CLK
SW_Quartz: UG2.1(CONTROL) ; port SW_Quartz

Not connected (* = marked no-connect by the designer): Uclk1 7(NC) 11(nQ2) 12(Q2) 13(nQ1) 14(Q1)

### Notes on the sheet
- (in symbol MAX4651PP, part A) +; G
- (in symbol MAX4651PP, part B) +; G
- (in symbol SG-636) Crystal; Oscillator

### Library data of the parts
Cgen1 = C: Text Field1: 20; Text Field2: 10
UG1 = SG-636: Crystal Oscillator (SMD)
UG2 = MAX4651PP: Text Field1: 20; Text Field2: 40

## Sheet In_Prev_Channel.SchDoc
size A4
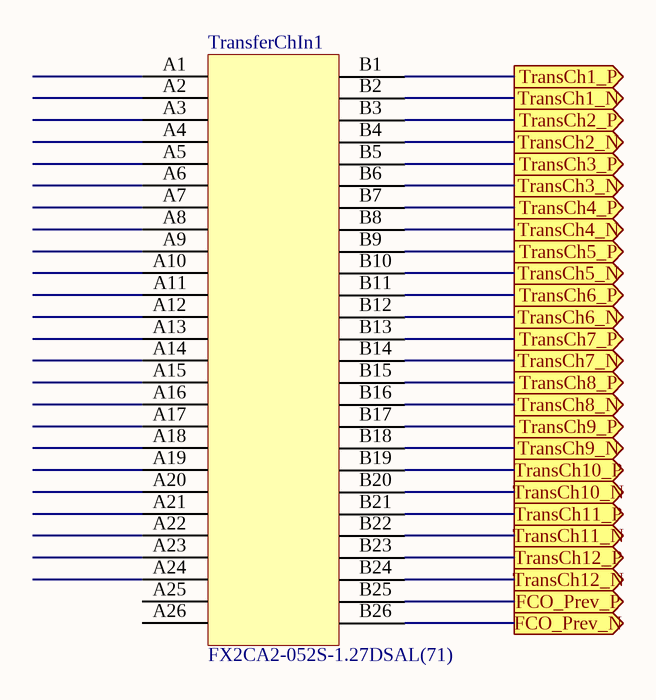
[diagram p12: In_Prev_Channel.SchDoc]

### Parts
TransferChIn1  FX2CA2-052S-1.27DSAL(71)  [FX2CA2-052S-1.27DSAL(71)]

### Ports
FCO_Prev_N (out), FCO_Prev_P (out), TransCh1_N (out), TransCh1_P (out), TransCh2_N (out), TransCh2_P (out), TransCh3_N (out), TransCh3_P (out), TransCh4_N (out), TransCh4_P (out), TransCh5_N (out), TransCh5_P (out), TransCh6_N (out), TransCh6_P (out), TransCh7_N (out), TransCh7_P (out), TransCh8_N (out), TransCh8_P (out), TransCh9_N (out), TransCh9_P (out), TransCh10_N (out), TransCh10_P (out), TransCh11_N (out), TransCh11_P (out), TransCh12_N (out), TransCh12_P (out)

### Nets
FCO_Prev_N: TransferChIn1.B26 ; port FCO_Prev_N
FCO_Prev_P: TransferChIn1.B25 ; port FCO_Prev_P
PrevCh1_N: TransferChIn1.B2 ; port TransCh1_N
PrevCh1_P: TransferChIn1.B1 ; port TransCh1_P
PrevCh2_N: TransferChIn1.B4 ; port TransCh2_N
PrevCh2_P: TransferChIn1.B3 ; port TransCh2_P
PrevCh3_N: TransferChIn1.B6 ; port TransCh3_N
PrevCh3_P: TransferChIn1.B5 ; port TransCh3_P
PrevCh4_N: TransferChIn1.B8 ; port TransCh4_N
PrevCh4_P: TransferChIn1.B7 ; port TransCh4_P
PrevCh5_N: TransferChIn1.B10 ; port TransCh5_N
PrevCh5_P: TransferChIn1.B9 ; port TransCh5_P
PrevCh6_N: TransferChIn1.B12 ; port TransCh6_N
PrevCh6_P: TransferChIn1.B11 ; port TransCh6_P
PrevCh7_N: TransferChIn1.B14 ; port TransCh7_N
PrevCh7_P: TransferChIn1.B13 ; port TransCh7_P
PrevCh8_N: TransferChIn1.B16 ; port TransCh8_N
PrevCh8_P: TransferChIn1.B15 ; port TransCh8_P
PrevCh9_N: TransferChIn1.B18 ; port TransCh9_N
PrevCh9_P: TransferChIn1.B17 ; port TransCh9_P
PrevCh10_N: TransferChIn1.B20 ; port TransCh10_N
PrevCh10_P: TransferChIn1.B19 ; port TransCh10_P
PrevCh11_N: TransferChIn1.B22 ; port TransCh11_N
PrevCh11_P: TransferChIn1.B21 ; port TransCh11_P
PrevCh12_N: TransferChIn1.B24 ; port TransCh12_N
PrevCh12_P: TransferChIn1.B23 ; port TransCh12_P

Not connected (* = marked no-connect by the designer): TransferChIn1 A1(1) A2(2) A3(3) A4(4) A5(5) A6(6) A7(7) A8(8) A9(9) A10(10) A11(11) A12(12) A13(13) A14(14) A15(15) A16(16) A17(17) A18(18) A19(19) A20(20) A21 A22 A23 A24 A25 A26

## Sheet Out_Next_Channel.SchDoc
size A4
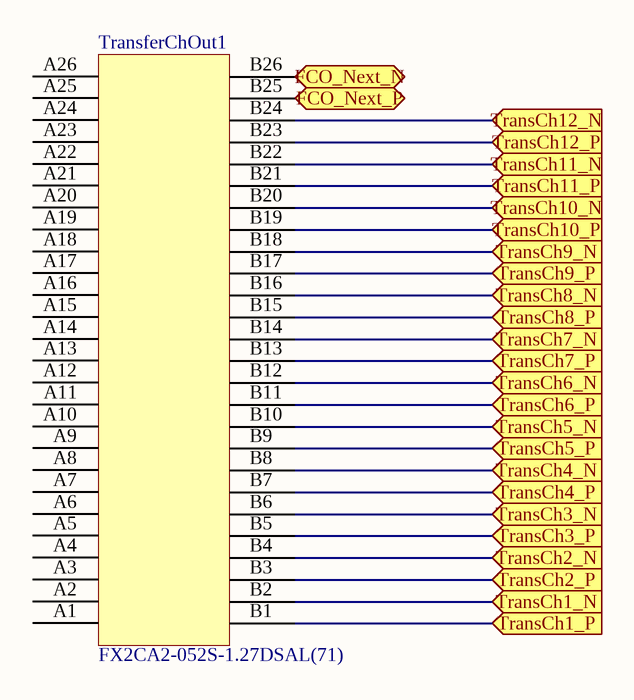
[diagram p13: Out_Next_Channel.SchDoc]

### Parts
TransferChOut1  FX2CA2-052S-1.27DSAL(71)  [FX2CA2-052S-1.27DSAL(71)]

### Ports
FCO_Next_N (in), FCO_Next_P (in), TransCh1_N (in), TransCh1_P (in), TransCh2_N (in), TransCh2_P (in), TransCh3_N (in), TransCh3_P (in), TransCh4_N (in), TransCh4_P (in), TransCh5_N (in), TransCh5_P (in), TransCh6_N (in), TransCh6_P (in), TransCh7_N (in), TransCh7_P (in), TransCh8_N (in), TransCh8_P (in), TransCh9_N (in), TransCh9_P (in), TransCh10_N (in), TransCh10_P (in), TransCh11_N (in), TransCh11_P (in), TransCh12_N (in), TransCh12_P (in)

### Nets
FCO_Next_N: TransferChOut1.B26 ; port FCO_Next_N
FCO_Next_P: TransferChOut1.B25 ; port FCO_Next_P
NextCh1_N: TransferChOut1.B2 ; port TransCh1_N
NextCh1_P: TransferChOut1.B1 ; port TransCh1_P
NextCh2_N: TransferChOut1.B4 ; port TransCh2_N
NextCh2_P: TransferChOut1.B3 ; port TransCh2_P
NextCh3_N: TransferChOut1.B6 ; port TransCh3_N
NextCh3_P: TransferChOut1.B5 ; port TransCh3_P
NextCh4_N: TransferChOut1.B8 ; port TransCh4_N
NextCh4_P: TransferChOut1.B7 ; port TransCh4_P
NextCh5_N: TransferChOut1.B10 ; port TransCh5_N
NextCh5_P: TransferChOut1.B9 ; port TransCh5_P
NextCh6_N: TransferChOut1.B12 ; port TransCh6_N
NextCh6_P: TransferChOut1.B11 ; port TransCh6_P
NextCh7_N: TransferChOut1.B14 ; port TransCh7_N
NextCh7_P: TransferChOut1.B13 ; port TransCh7_P
NextCh8_N: TransferChOut1.B16 ; port TransCh8_N
NextCh8_P: TransferChOut1.B15 ; port TransCh8_P
NextCh9_N: TransferChOut1.B18 ; port TransCh9_N
NextCh9_P: TransferChOut1.B17 ; port TransCh9_P
NextCh10_N: TransferChOut1.B20 ; port TransCh10_N
NextCh10_P: TransferChOut1.B19 ; port TransCh10_P
NextCh11_N: TransferChOut1.B22 ; port TransCh11_N
NextCh11_P: TransferChOut1.B21 ; port TransCh11_P
NextCh12_N: TransferChOut1.B24 ; port TransCh12_N
NextCh12_P: TransferChOut1.B23 ; port TransCh12_P

Not connected (* = marked no-connect by the designer): TransferChOut1 A1(1) A2(2) A3(3) A4(4) A5(5) A6(6) A7(7) A8(8) A9(9) A10(10) A11(11) A12(12) A13(13) A14(14) A15(15) A16(16) A17(17) A18(18) A19(19) A20(20) A21 A22 A23 A24 A25 A26

## Nets that join several sheets
+1.8 V: In_Ch1 (6 pins), In_Ch2 (6 pins), In_Ch3 (6 pins), In_Ch4 (6 pins), In_Ch5 (6 pins), In_Ch6 (6 pins), In_Ch7 (6 pins), In_Ch8 (6 pins), In_Ch9 (6 pins), In_Ch16 (6 pins), In_Ch15 (6 pins), In_Ch14 (6 pins), In_Ch13 (6 pins), In_Ch12 (6 pins), In_Ch11 (6 pins), In_Ch10 (6 pins)
+1.8 Vdig: In_Ch1 (InChCon1_In_Ch1.A20), Supply (Csup13.+ Csup18.1 Usup4.2 Usup4.4), In_Ch2 (InChCon1_In_Ch2.A20), In_Ch3 (InChCon1_In_Ch3.A20), In_Ch4 (InChCon1_In_Ch4.A20), In_Ch5 (InChCon1_In_Ch5.A20), In_Ch6 (InChCon1_In_Ch6.A20), In_Ch7 (InChCon1_In_Ch7.A20), In_Ch8 (InChCon1_In_Ch8.A20), In_Ch9 (InChCon1_In_Ch9.A20), In_Ch16 (InChCon1_In_Ch16.A20), In_Ch15 (InChCon1_In_Ch15.A20), In_Ch14 (InChCon1_In_Ch14.A20), In_Ch13 (InChCon1_In_Ch13.A20), In_Ch12 (InChCon1_In_Ch12.A20), In_Ch11 (InChCon1_In_Ch11.A20), In_Ch10 (InChCon1_In_Ch10.A20)
+3.3 V: Supply (Csup10.+ Csup15.1 Usup1.2 Usup1.4), Ethernet (12 pins), Clk (9 pins)
+5 V: Main_Trigger (CLED1.1 VDLED1.ANOD VDLED2.ANOD VDLED3.ANOD), In_Ch1 (C1_In_Ch1.1 InChCon1_In_Ch1.B23 InChCon1_In_Ch1.B25 Usup_ch1_In_Ch1.3), Supply (13 pins), FCT_connector (9 pins), In_Ch2 (C1_In_Ch2.1 InChCon1_In_Ch2.B23 InChCon1_In_Ch2.B25 Usup_ch1_In_Ch2.3), In_Ch3 (C1_In_Ch3.1 InChCon1_In_Ch3.B23 InChCon1_In_Ch3.B25 Usup_ch1_In_Ch3.3), In_Ch4 (C1_In_Ch4.1 InChCon1_In_Ch4.B23 InChCon1_In_Ch4.B25 Usup_ch1_In_Ch4.3), In_Ch5 (C1_In_Ch5.1 InChCon1_In_Ch5.B23 InChCon1_In_Ch5.B25 Usup_ch1_In_Ch5.3), In_Ch6 (C1_In_Ch6.1 InChCon1_In_Ch6.B23 InChCon1_In_Ch6.B25 Usup_ch1_In_Ch6.3), In_Ch7 (C1_In_Ch7.1 InChCon1_In_Ch7.B23 InChCon1_In_Ch7.B25 Usup_ch1_In_Ch7.3), In_Ch8 (C1_In_Ch8.1 InChCon1_In_Ch8.B23 InChCon1_In_Ch8.B25 Usup_ch1_In_Ch8.3), In_Ch9 (C1_In_Ch9.1 InChCon1_In_Ch9.B23 InChCon1_In_Ch9.B25 Usup_ch1_In_Ch9.3), In_Ch16 (C1_In_Ch16.1 InChCon1_In_Ch16.B23 InChCon1_In_Ch16.B25 Usup_ch1_In_Ch16.3), In_Ch15 (C1_In_Ch15.1 InChCon1_In_Ch15.B23 InChCon1_In_Ch15.B25 Usup_ch1_In_Ch15.3), In_Ch14 (C1_In_Ch14.1 InChCon1_In_Ch14.B23 InChCon1_In_Ch14.B25 Usup_ch1_In_Ch14.3), In_Ch13 (C1_In_Ch13.1 InChCon1_In_Ch13.B23 InChCon1_In_Ch13.B25 Usup_ch1_In_Ch13.3), In_Ch12 (C1_In_Ch12.1 InChCon1_In_Ch12.B23 InChCon1_In_Ch12.B25 Usup_ch1_In_Ch12.3), In_Ch11 (C1_In_Ch11.1 InChCon1_In_Ch11.B23 InChCon1_In_Ch11.B25 Usup_ch1_In_Ch11.3), In_Ch10 (C1_In_Ch10.1 InChCon1_In_Ch10.B23 InChCon1_In_Ch10.B25 Usup_ch1_In_Ch10.3)
-5 V: In_Ch1 (InChCon1_In_Ch1.B1 InChCon1_In_Ch1.B3), Supply (Csup2.+ Csup4.1 Lref2.2), In_Ch2 (InChCon1_In_Ch2.B1 InChCon1_In_Ch2.B3), In_Ch3 (InChCon1_In_Ch3.B1 InChCon1_In_Ch3.B3), In_Ch4 (InChCon1_In_Ch4.B1 InChCon1_In_Ch4.B3), In_Ch5 (InChCon1_In_Ch5.B1 InChCon1_In_Ch5.B3), In_Ch6 (InChCon1_In_Ch6.B1 InChCon1_In_Ch6.B3), In_Ch7 (InChCon1_In_Ch7.B1 InChCon1_In_Ch7.B3), In_Ch8 (InChCon1_In_Ch8.B1 InChCon1_In_Ch8.B3), In_Ch9 (InChCon1_In_Ch9.B1 InChCon1_In_Ch9.B3), In_Ch16 (InChCon1_In_Ch16.B1 InChCon1_In_Ch16.B3), In_Ch15 (InChCon1_In_Ch15.B1 InChCon1_In_Ch15.B3), In_Ch14 (InChCon1_In_Ch14.B1 InChCon1_In_Ch14.B3), In_Ch13 (InChCon1_In_Ch13.B1 InChCon1_In_Ch13.B3), In_Ch12 (InChCon1_In_Ch12.B1 InChCon1_In_Ch12.B3), In_Ch11 (InChCon1_In_Ch11.B1 InChCon1_In_Ch11.B3), In_Ch10 (InChCon1_In_Ch10.B1 InChCon1_In_Ch10.B3)
GND: Main_Trigger (18 pins), In_Ch1 (10 pins), Supply (24 pins), FCT_connector (158 pins), In_Ch2 (10 pins), In_Ch3 (10 pins), In_Ch4 (10 pins), In_Ch5 (10 pins), Ethernet (32 pins), In_Ch6 (10 pins), In_Ch7 (10 pins), In_Ch8 (10 pins), In_Ch9 (10 pins), In_Ch16 (10 pins), In_Ch15 (10 pins), In_Ch14 (10 pins), In_Ch13 (10 pins), In_Ch12 (10 pins), In_Ch11 (10 pins), In_Ch10 (10 pins), Clk (Cgen1.1 Uclk1.5 UG1.2 UG2.5)
ADC_CSB: In_Ch1 (InChCon1_In_Ch1.A1), In_Ch2 (InChCon1_In_Ch2.A1), In_Ch3 (InChCon1_In_Ch3.A1), In_Ch4 (InChCon1_In_Ch4.A1), In_Ch5 (InChCon1_In_Ch5.A1), In_Ch6 (InChCon1_In_Ch6.A1), In_Ch7 (InChCon1_In_Ch7.A1), In_Ch8 (InChCon1_In_Ch8.A1), In_Ch9 (InChCon1_In_Ch9.A1), In_Ch16 (InChCon1_In_Ch16.A1), In_Ch15 (InChCon1_In_Ch15.A1), In_Ch14 (InChCon1_In_Ch14.A1), In_Ch13 (InChCon1_In_Ch13.A1), In_Ch12 (InChCon1_In_Ch12.A1), In_Ch11 (InChCon1_In_Ch11.A1), In_Ch10 (InChCon1_In_Ch10.A1)
ADC_DOWN_CLK_N: In_Ch1 (InChCon1_In_Ch1.A22), In_Ch2 (InChCon1_In_Ch2.A22), In_Ch3 (InChCon1_In_Ch3.A22), In_Ch4 (InChCon1_In_Ch4.A22), In_Ch5 (InChCon1_In_Ch5.A22), In_Ch6 (InChCon1_In_Ch6.A22), In_Ch7 (InChCon1_In_Ch7.A22), In_Ch8 (InChCon1_In_Ch8.A22), Clk (Uclk1.9)
ADC_DOWN_CLK_P: In_Ch1 (InChCon1_In_Ch1.A21), In_Ch2 (InChCon1_In_Ch2.A21), In_Ch3 (InChCon1_In_Ch3.A21), In_Ch4 (InChCon1_In_Ch4.A21), In_Ch5 (InChCon1_In_Ch5.A21), In_Ch6 (InChCon1_In_Ch6.A21), In_Ch7 (InChCon1_In_Ch7.A21), In_Ch8 (InChCon1_In_Ch8.A21), Clk (Uclk1.10)
ADC_SCLK: In_Ch1 (InChCon1_In_Ch1.A3), In_Ch2 (InChCon1_In_Ch2.A3), In_Ch3 (InChCon1_In_Ch3.A3), In_Ch4 (InChCon1_In_Ch4.A3), In_Ch5 (InChCon1_In_Ch5.A3), In_Ch6 (InChCon1_In_Ch6.A3), In_Ch7 (InChCon1_In_Ch7.A3), In_Ch8 (InChCon1_In_Ch8.A3), In_Ch9 (InChCon1_In_Ch9.A3), In_Ch16 (InChCon1_In_Ch16.A3), In_Ch15 (InChCon1_In_Ch15.A3), In_Ch14 (InChCon1_In_Ch14.A3), In_Ch13 (InChCon1_In_Ch13.A3), In_Ch12 (InChCon1_In_Ch12.A3), In_Ch11 (InChCon1_In_Ch11.A3), In_Ch10 (InChCon1_In_Ch10.A3)
ADC_SDIO/ODM: In_Ch1 (InChCon1_In_Ch1.A2), In_Ch2 (InChCon1_In_Ch2.A2), In_Ch3 (InChCon1_In_Ch3.A2), In_Ch4 (InChCon1_In_Ch4.A2), In_Ch5 (InChCon1_In_Ch5.A2), In_Ch6 (InChCon1_In_Ch6.A2), In_Ch7 (InChCon1_In_Ch7.A2), In_Ch8 (InChCon1_In_Ch8.A2), In_Ch9 (InChCon1_In_Ch9.A2), In_Ch16 (InChCon1_In_Ch16.A2), In_Ch15 (InChCon1_In_Ch15.A2), In_Ch14 (InChCon1_In_Ch14.A2), In_Ch13 (InChCon1_In_Ch13.A2), In_Ch12 (InChCon1_In_Ch12.A2), In_Ch11 (InChCon1_In_Ch11.A2), In_Ch10 (InChCon1_In_Ch10.A2)
ADC_UP_CLK_N: In_Ch9 (InChCon1_In_Ch9.A22), In_Ch16 (InChCon1_In_Ch16.A22), In_Ch15 (InChCon1_In_Ch15.A22), In_Ch14 (InChCon1_In_Ch14.A22), In_Ch13 (InChCon1_In_Ch13.A22), In_Ch12 (InChCon1_In_Ch12.A22), In_Ch11 (InChCon1_In_Ch11.A22), In_Ch10 (InChCon1_In_Ch10.A22), Clk (Uclk1.15)
ADC_UP_CLK_P: In_Ch9 (InChCon1_In_Ch9.A21), In_Ch16 (InChCon1_In_Ch16.A21), In_Ch15 (InChCon1_In_Ch15.A21), In_Ch14 (InChCon1_In_Ch14.A21), In_Ch13 (InChCon1_In_Ch13.A21), In_Ch12 (InChCon1_In_Ch12.A21), In_Ch11 (InChCon1_In_Ch11.A21), In_Ch10 (InChCon1_In_Ch10.A21), Clk (Uclk1.16)
Calib: In_Ch1 (InChCon1_In_Ch1.B26), In_Ch2 (InChCon1_In_Ch2.B26), In_Ch3 (InChCon1_In_Ch3.B26), In_Ch4 (InChCon1_In_Ch4.B26), In_Ch5 (InChCon1_In_Ch5.B26), In_Ch6 (InChCon1_In_Ch6.B26), In_Ch7 (InChCon1_In_Ch7.B26), In_Ch8 (InChCon1_In_Ch8.B26), In_Ch9 (InChCon1_In_Ch9.B26), In_Ch16 (InChCon1_In_Ch16.B26), In_Ch15 (InChCon1_In_Ch15.B26), In_Ch14 (InChCon1_In_Ch14.B26), In_Ch13 (InChCon1_In_Ch13.B26), In_Ch12 (InChCon1_In_Ch12.B26)
FQuartz: Ethernet (R3.1 U15.1), Clk (UG1.3 UG2.2)